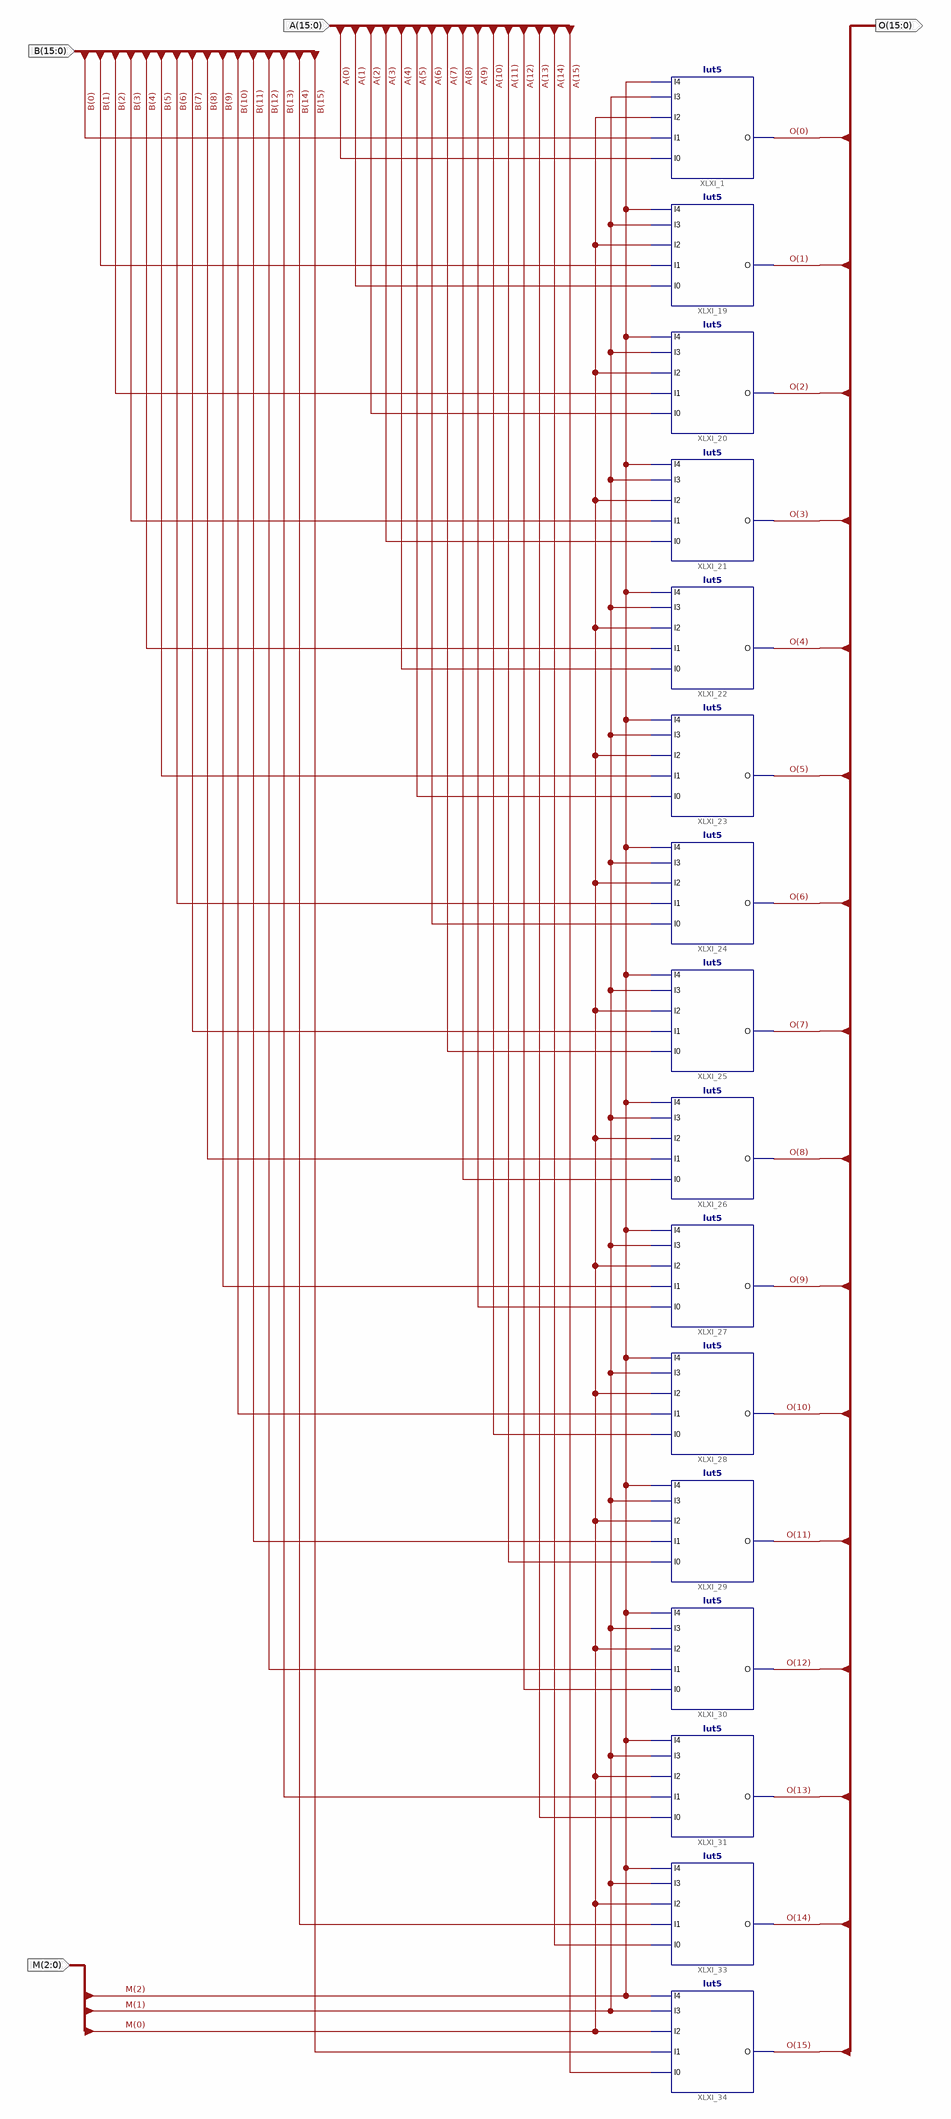
[diagram p0: schematic sheet 1]
// Xilinx ISE schematic logic.sch (spartan6) as structural Verilog: 16 symbols, 4 ports
module \logic  (
  input  [15:0] B,
  input  [15:0] A,
  input  [2:0] M,
  output [15:0] O
);

  lut5 #(.INIT("9176E85A")) XLXI_1 (.I0(A[0]), .I1(B[0]), .I2(M[0]), .I3(M[1]), .O(O[0]), .I4(M[2]));
  lut5 #(.INIT("9176E85A")) XLXI_19 (.I0(A[1]), .I1(B[1]), .I2(M[0]), .I3(M[1]), .O(O[1]), .I4(M[2]));
  lut5 #(.INIT("9176E85A")) XLXI_20 (.I0(A[2]), .I1(B[2]), .I2(M[0]), .I3(M[1]), .O(O[2]), .I4(M[2]));
  lut5 #(.INIT("9176E85A")) XLXI_21 (.I0(A[3]), .I1(B[3]), .I2(M[0]), .I3(M[1]), .O(O[3]), .I4(M[2]));
  lut5 #(.INIT("9176E85A")) XLXI_22 (.I0(A[4]), .I1(B[4]), .I2(M[0]), .I3(M[1]), .O(O[4]), .I4(M[2]));
  lut5 #(.INIT("9176E85A")) XLXI_23 (.I0(A[5]), .I1(B[5]), .I2(M[0]), .I3(M[1]), .O(O[5]), .I4(M[2]));
  lut5 #(.INIT("9176E85A")) XLXI_24 (.I0(A[6]), .I1(B[6]), .I2(M[0]), .I3(M[1]), .O(O[6]), .I4(M[2]));
  lut5 #(.INIT("9176E85A")) XLXI_25 (.I0(A[7]), .I1(B[7]), .I2(M[0]), .I3(M[1]), .O(O[7]), .I4(M[2]));
  lut5 #(.INIT("9176E85A")) XLXI_26 (.I0(A[8]), .I1(B[8]), .I2(M[0]), .I3(M[1]), .O(O[8]), .I4(M[2]));
  lut5 #(.INIT("9176E85A")) XLXI_27 (.I0(A[9]), .I1(B[9]), .I2(M[0]), .I3(M[1]), .O(O[9]), .I4(M[2]));
  lut5 #(.INIT("9176E85A")) XLXI_28 (.I0(A[10]), .I1(B[10]), .I2(M[0]), .I3(M[1]), .O(O[10]), .I4(M[2]));
  lut5 #(.INIT("9176E85A")) XLXI_29 (.I0(A[11]), .I1(B[11]), .I2(M[0]), .I3(M[1]), .O(O[11]), .I4(M[2]));
  lut5 #(.INIT("9176E85A")) XLXI_30 (.I0(A[12]), .I1(B[12]), .I2(M[0]), .I3(M[1]), .O(O[12]), .I4(M[2]));
  lut5 #(.INIT("9176E85A")) XLXI_31 (.I0(A[13]), .I1(B[13]), .I2(M[0]), .I3(M[1]), .O(O[13]), .I4(M[2]));
  lut5 #(.INIT("9176E85A")) XLXI_33 (.I0(A[14]), .I1(B[14]), .I2(M[0]), .I3(M[1]), .O(O[14]), .I4(M[2]));
  lut5 #(.INIT("9176E85A")) XLXI_34 (.I0(A[15]), .I1(B[15]), .I2(M[0]), .I3(M[1]), .O(O[15]), .I4(M[2]));
endmodule
